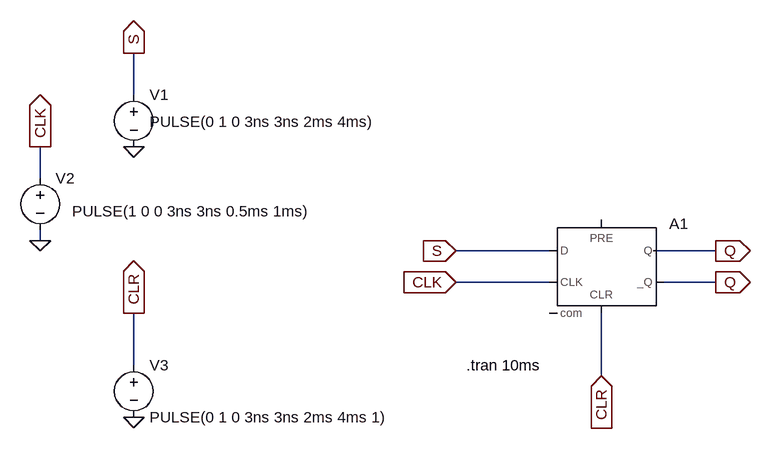
[diagram p0: schematic Registre.asc]
Registre.asc, the LTspice schematic file:
Version 4
SHEET 1 880 680
WIRE -464 -112 -464 -176
WIRE -608 16 -608 -32
WIRE -608 112 -608 96
WIRE 176 128 32 128
WIRE 432 128 336 128
WIRE 176 176 32 176
WIRE 432 176 352 176
WIRE -464 304 -464 224
WIRE 256 320 256 224
FLAG -464 -32 0
FLAG -464 384 0
FLAG 432 128 Q
IOPIN 432 128 Out
FLAG 432 176 Q
IOPIN 432 176 Out
FLAG 256 320 CLR
IOPIN 256 320 In
FLAG 32 176 CLK
IOPIN 32 176 In
FLAG 32 128 S
IOPIN 32 128 In
FLAG -464 -176 S
IOPIN -464 -176 Out
FLAG -464 224 CLR
IOPIN -464 224 Out
FLAG -608 112 0
FLAG -608 -32 CLK
IOPIN -608 -32 Out
SYMBOL Digital\\dflop 256 80 R0
SYMATTR InstName A1
SYMBOL voltage -464 -128 R0
WINDOW 3 24 57 Left 2
WINDOW 123 0 0 Left 0
WINDOW 39 0 0 Left 0
SYMATTR InstName V1
SYMATTR Value PULSE(0 1 0 3ns 3ns 2ms 4ms)
SYMBOL voltage -464 288 R0
WINDOW 123 0 0 Left 0
WINDOW 39 0 0 Left 0
SYMATTR InstName V3
SYMATTR Value PULSE(0 1 0 3ns 3ns 2ms 4ms 1)
SYMBOL voltage -608 0 R0
WINDOW 3 49 67 Left 2
WINDOW 123 0 0 Left 0
WINDOW 39 0 0 Left 0
SYMATTR InstName V2
SYMATTR Value PULSE(1 0 0 3ns 3ns 0.5ms 1ms)
TEXT 48 304 Left 2 !.tran 10ms

The netlist it stands for:
* Registre.asc
A1 S 0 CLK 0 CLR Q Q 0 DFLOP
V1 S 0 PULSE(0 1 0 3ns 3ns 2ms 4ms)
V3 CLR 0 PULSE(0 1 0 3ns 3ns 2ms 4ms 1)
V2 CLK 0 PULSE(1 0 0 3ns 3ns 0.5ms 1ms)
.tran 10ms
.backanno
.end

* Results of the author's LTspice run, read from the files saved beside the schematic
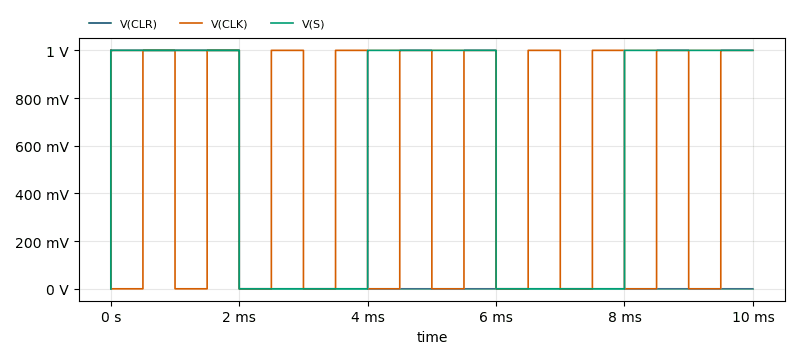
[diagram p1: Transient Analysis of Registre.asc, plotted from the saved traces]
* Transient Analysis, 1 run:
*   V(CLR): min 0 V, max 1 V, average 200 mV, rms 447.2 mV, last 0 V
*   V(CLK): min 0 V, max 1 V, average 500 mV, rms 707.1 mV, last 1 V
*   V(S): min 0 V, max 1 V, average 600 mV, rms 774.6 mV, last 1 V